# Altium schematic sheet 6.ETCAT.SchDoc
size A3; SheetNumber: 7; SheetTotal: 11
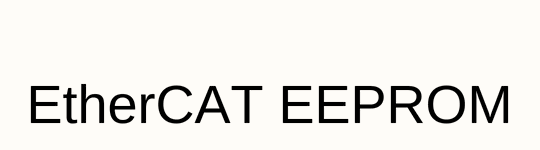
[diagram p0: 6.ETCAT.SchDoc]

## Notes on the sheet
- EtherCAT EEPROM